# Altium schematic sheet Kill_Switch.SchDoc: Kill Switch
size B; Date: 01/03/2026; Author: John Ulm; Organization: ORGANIZATION; Address1: ADDRESS 1; Address2: ADDRESS 2; Address3: ADDRESS 3; Address4: ADDRESS 4; Revision: -; SheetNumber: 2; SheetTotal: 6; ENG_APP_DATE: --/--/--; DSN_APP_DATE: --/--/--; CHK_APP_DATE: --/--/--
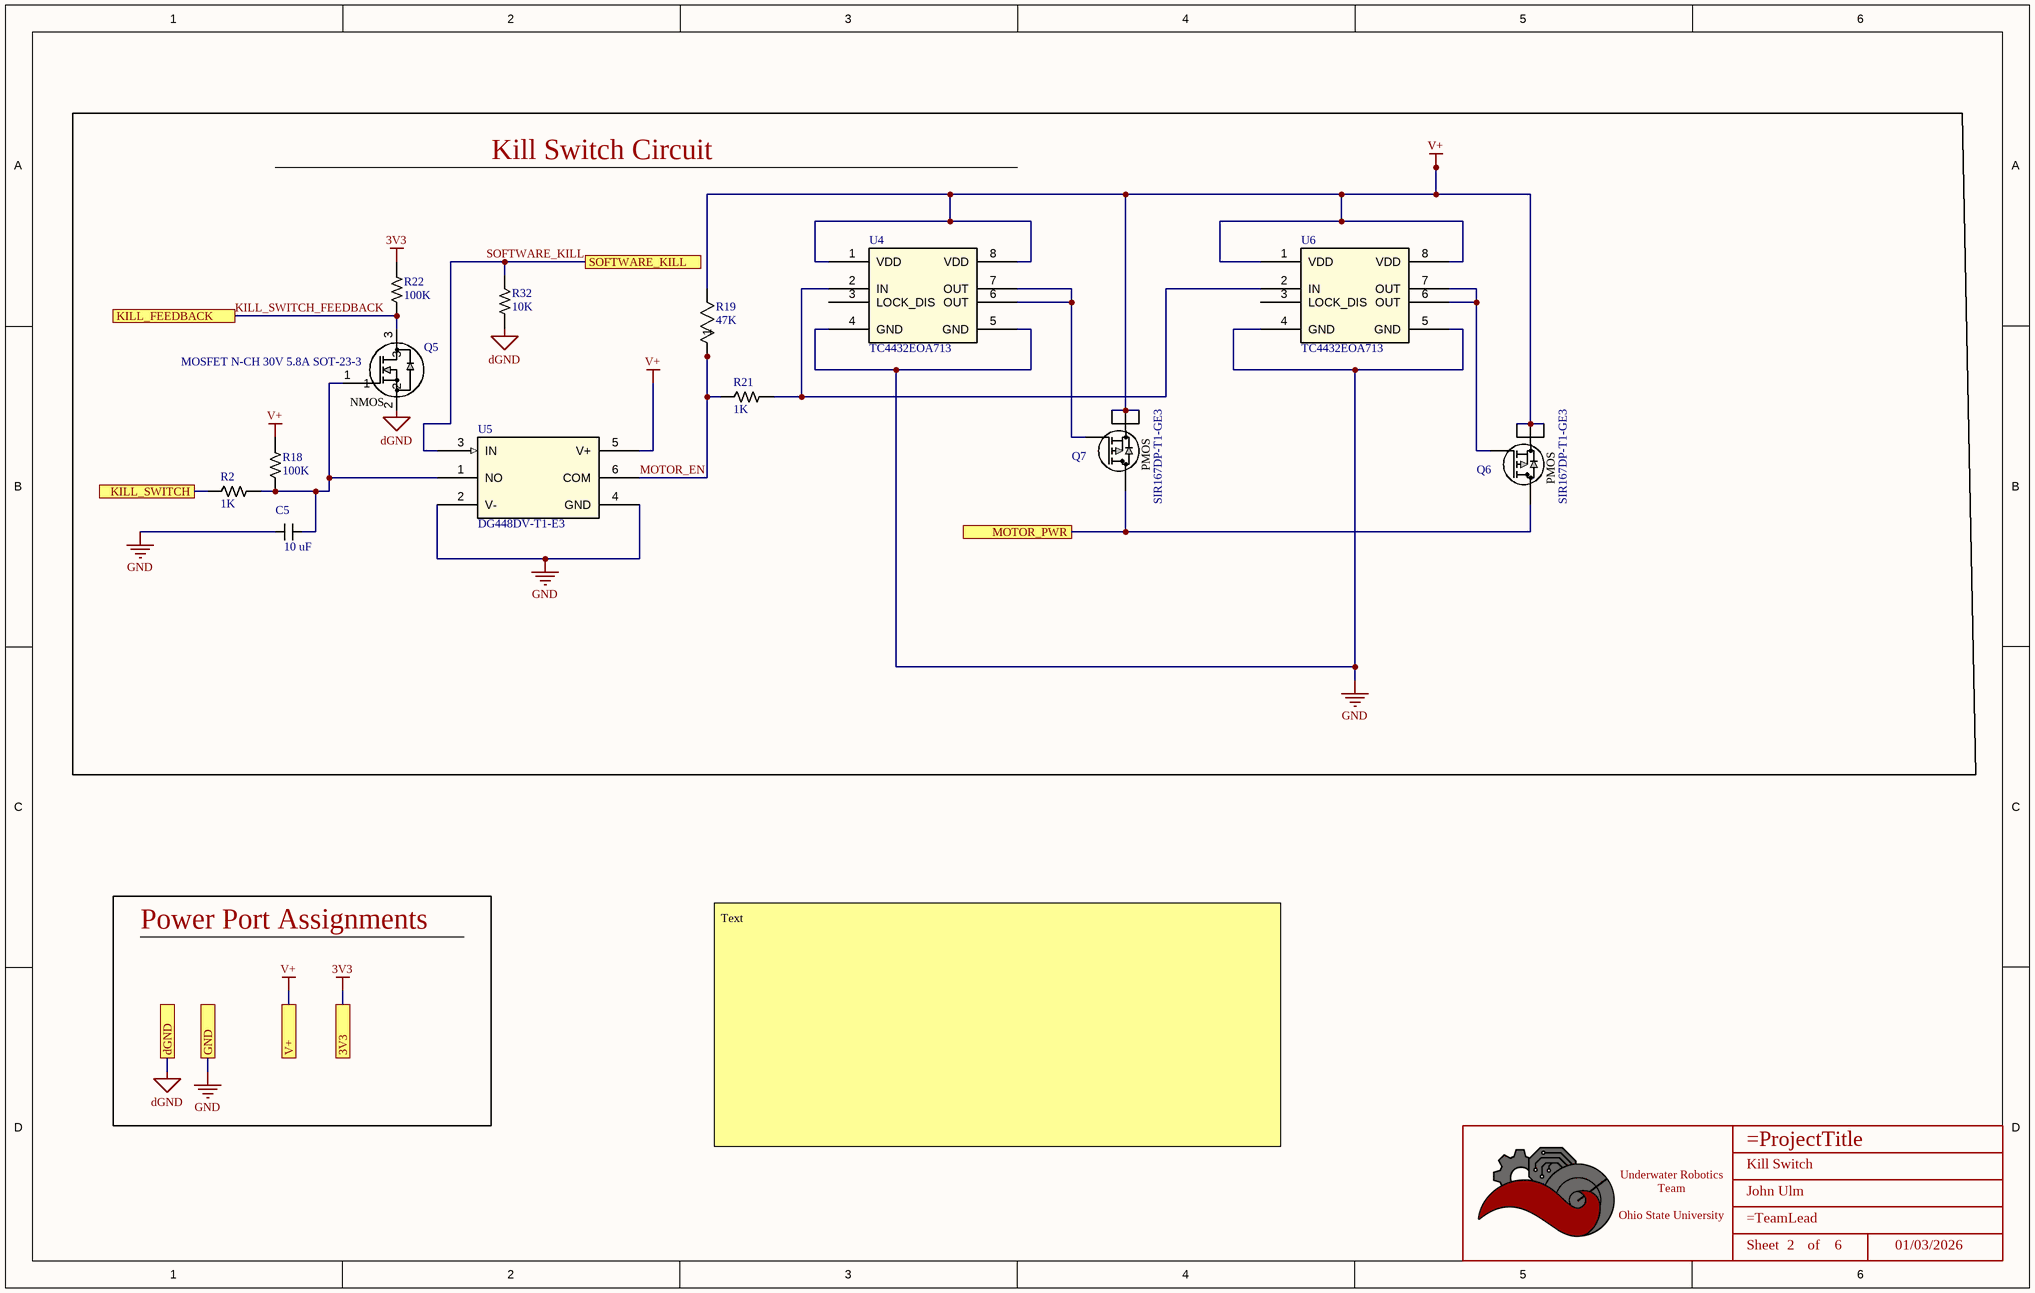
[diagram p0: Kill_Switch.SchDoc]

## Parts
*  Title_Block  [LOGO]  (value not drawn)  (graphical)
C5  Value (uF): 10 uF  [CAPACITOR_1206]  (hidden comment: 10uF Ceramic 25V)
Q5  MOSFET N-CH 30V 5.8A SOT-23-3  [SOT-23-3]
Q6  SIR167DP-T1-GE3  [MOSFET_7DP-T1-GE3_VIS]
Q7  SIR167DP-T1-GE3  [MOSFET_7DP-T1-GE3_VIS]
R2  Value  (Ohms): 1K  [RESISTOR_0603]  (hidden comment: 1k Ohm 5% 1/8W)
R18  Value  (Ohms): 100K  [RESISTOR_0603]  (hidden comment: 100k Ohm 0.5% 1/10W)
R19  47K  [CAPACITOR_0603]
R21  Value  (Ohms): 1K  [RESISTOR_0402]  (hidden comment: 1k Ohm 1% 1/16W)
R22  Value  (Ohms): 100K  [RESISTOR_0603]  (hidden comment: 100k Ohm 0.5% 1/10W)
R32  Value  (Ohms): 10K  [RESISTOR_0603]  (hidden comment: 10k Ohm 5% 1/10W)
U4  TC4432EOA713  [SOIC8-N_MC_MCH]
U5  DG448DV-T1-E3  [TSOP6_DG_VIS-M]
U6  TC4432EOA713  [SOIC8-N_MC_MCH]

## Blocks framed on the sheet
Kill Switch Circuit: C5 Q5-Q7 R2 R18 R19 R21 R22 R32 U4-U6

## Ports
3V3, dGND, GND, KILL_FEEDBACK, KILL_SWITCH, MOTOR_PWR, SOFTWARE_KILL, V+

## Nets
3V3: R22.1 ; port 3V3
dGND: Q5.2 R32.1 ; port dGND
GND: C5.2 U4.4(GND) U4.5(GND) U5.2(V-) U5.4(GND) U6.4(GND) U6.5(GND) ; port GND
V+: Q6.1(S) Q6.2(S) Q6.3(S) Q7.1(S) Q7.2(S) Q7.3(S) R18.1 R19.2 U4.1(VDD) U4.8(VDD) U5.5(V+) U6.1(VDD) U6.8(VDD) ; port V+
KILL_SWITCH: R2.2 ; port KILL_SWITCH
KILL_SWITCH_FEEDBACK: Q5.3 R22.2 ; port KILL_FEEDBACK
MOTOR_EN: R19.1 R21.2 U5.6(COM)
MOTOR_PWR: Q6.D Q7.D ; port MOTOR_PWR
SOFTWARE_KILL: R32.2 U5.3(IN) ; port SOFTWARE_KILL
NetC5_1: C5.1 Q5.1 R2.1 R18.2 U5.1(NO)
NetQ6_4: Q6.4(G) U6.6(OUT) U6.7(OUT)
NetQ7_4: Q7.4(G) U4.6(OUT) U4.7(OUT)
NetR21_1: R21.1 U4.2(IN) U6.2(IN)

Not connected (* = marked no-connect by the designer): U4 3(LOCK_DIS); U6 3(LOCK_DIS)

## Notes on the sheet
- Power Port Assignments
- Text
- DWG. NO.
- REV.
- SHT.
- THIS DOCUMENT AND THE DATA DISCLOSED HEREIN OR HEREWITH IS THE PROPERTY OF ALTIUM LIMITED AND MAY BE FREELY DISTRIBUTED IN WHOLE. NO RIGHTS ARE RESERVED OR EXPRESS OR IMPLIED WARANTEE GIVEN.
- REVISION
- DESCRIPTION
- DATE
- APPROVED
- ENG:
- APPROVALS
- PROJECT
- DSN:
- CHK:
- REFERENCE DOCUMENTS
- PROJECT REVISION:
- TITLE
- DOCUMENT REVISION:
- DESIGN ITEM:
- BOM:
- FAB DWG:
- PCB DWG:
- ASSY DWG:
- SCALE:
- SIZE
- B
- CAGE CODE
- FILE NAME
- DWG NO.
- SHEET
- OF
- REV
- (in symbol AO3404A) NMOS
- (in symbol SIR167DP-T1-GE3) PMOS
- (in symbol Title_Block) Underwater Robotics Team / Ohio State University; Sheet; of

## Library data of the parts
* = Title_Block: UWRT Schematic Title Block Template / Created June 2021, Dylan Trainor
C5 = CAPACITOR_10uF_1206: Cap 10uF 25V +/-10% / Ceramic 1206; Made By: Robert Pafford; Tolerance: +/- 10%; Voltage: 25V; Supplier 1: Digi-Key; Supplier Part Number 1: 1276-1804-6-ND
Q5 = AO3404A: N-Channel 30 V 5.8A (Ta) 1.4W (Ta) Surface Mount SOT-23-3; Vendor: Alpha & Omega Semiconductor Inc.; SourceLibrary: ON_Semiconductor_2020-01-13; Vgs (Max): 3V @ 5.8A, 10V; Vgs (th): 3V @ 250µA; Rds (on): 28mOhm @ 5.8A, 10V; Amp Rating: 5.8 A; FET Type: N-Channel; Package: SOT23-3L; Manufacturer _Part_Number: AO3404A; Vdss: 30V; Power Dissipation: 1.4W (Ta); Supplier 1: Digi-Key; Supplier Part Number 1: 785-1004-1-ND; Created By: Dylan T
Q6 Q7 = SIR167DP-T1-GE3: P-Channel 30 V 60A (Tc) 65.8W (Tc) Surface Mount PowerPAK® SO-8; Mfr_Name: Vishay; Type: DEV; Copyright: Copyright (C) 2022 Ultra Librarian. All rights reserved.; Manufacturer_Part_Number: SIR167DP-T1-GE3; RefDes: RefDes; Supplier 1: Mouser; Supplier Part Number 1: 78-SIR167DP-T1-GE3
R2 = RESISTOR_1K_0603: RES 1k OHM 5% 1/8W 0603; Tolerance: +/- 5%; Made By: Robert Pafford; ComponentLink1Description: Datasheet; ComponentLink1URL: https://www.bourns.com/docs/product-datasheets/CRxxxxx.pdf; Wattage: 1/8W; Supplier: Digikey; Digikey Part Numer: CR0603-JW-104ELFTR-ND; Supplier 1: Digi-Key; Supplier Part Number 1: 2019-RK73B1JTTD102JCT-ND
R18 R22 = RESISTOR_100K_0.5%_0603: RES 100k OHM 0.5% 1/10W 0603; Tolerance: +/- 0.5%; Made By: John Ulm; ComponentLink1Description: Datasheet; ComponentLink1URL: https://www.bourns.com/docs/product-datasheets/CRxxxxx.pdf; Wattage: 1/10W; Supplier: Digikey; Digikey Part Numer: CR0603-JW-104ELFTR-ND; Supplier 1: Digi-Key; Supplier Part Number 1: 311-2395-1-ND
R19 = RC0603JR-1347KL: 47kohm 0603 1/10w; Mfr_Name: Yageo; Copyright: Copyright (C) 2024 Ultra Librarian. All rights reserved.; Manufacturer_Part_Number: RC0603JR-1347KL; RefDes: RefDes; Type: DEV; Supplier 1: Mouser; Supplier Part Number 1: 667-ERJ-3GEYJ473V
R21 = RESISTOR_1K_0402: RES 1k OHM 1% 1/16W 0402; Tolerance: +/- 1%; Made By: Robert Pafford; Wattage: 1/16W; Supplier: Digikey; Digikey Part Numer: CR0603-JW-104ELFTR-ND; Supplier 1: Digi-Key; Supplier Part Number 1: 13-AC0402FR-131KLCT-ND
R32 = RESISTOR_10K_0603: RES 10k OHM 5% 1/10W 0603; Tolerance: +/- 5%; Wattage: 1/8W; Made By: Robert Pafford; ComponentLink1Description: Datasheet; ComponentLink1URL: https://www.bourns.com/docs/product-datasheets/CRxxxxx.pdf; Supplier: Digikey; Digikey Part Numer: CR0603-JW-104ELFTR-ND; Supplier 1: Digi-Key; Supplier Part Number 1: 2019-RK73B1JTTD103JCT-ND
U4 U6 = TC4432EOA713: High-Side or Low-Side Gate Driver IC Non-Inverting 8-SOIC; Mfr_Name: Microchip; Copyright: Copyright (C) 2024 Ultra Librarian. All rights reserved.; Manufacturer_Part_Number: TC4432EOA713; RefDes: RefDes; Type: DEV; Supplier 1: Digikey; Supplier Part Number 1: TC4432EOA713CT-ND
U5 = DG448DV-T1-E3: IC SWITCH SPST-NOX1 25OHM 6TSOP; Mfr_Name: Vishay; Copyright: Copyright (C) 2024 Ultra Librarian. All rights reserved.; Manufacturer_Part_Number: DG448DV-T1-E3; RefDes: RefDes; Type: DEV; Supplier 1: Mouser; Supplier Part Number 1: 781-DG448DV-E3